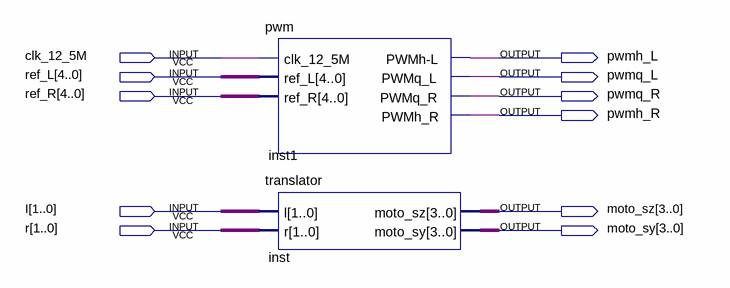
[diagram p0: schematic sheet]
// Quartus schematic moto_control.bdf as structural Verilog: 2 symbols, 11 pins
module moto_control (
  input  clk_12_5M,
  input  [4:0] ref_L,
  input  [4:0] ref_R,
  input  [1:0] I,
  input  [1:0] r,
  output pwmh_L,
  output pwmq_L,
  output pwmq_R,
  output pwmh_R,
  output [3:0] moto_sz,
  output [3:0] moto_sy
);

  pwm inst1 (
    .clk_12_5M(clk_12_5M), .ref_L(ref_L), .ref_R(ref_R), .\PWMh-L (pwmh_L), .PWMq_L(pwmq_L), .PWMq_R(pwmq_R),
    .PWMh_R(pwmh_R));
  translator inst (.l(I), .r(r), .moto_sz(moto_sz), .moto_sy(moto_sy));
endmodule
